# EAGLE design Relay_Board_R2 (EAGLE 7.7.0)
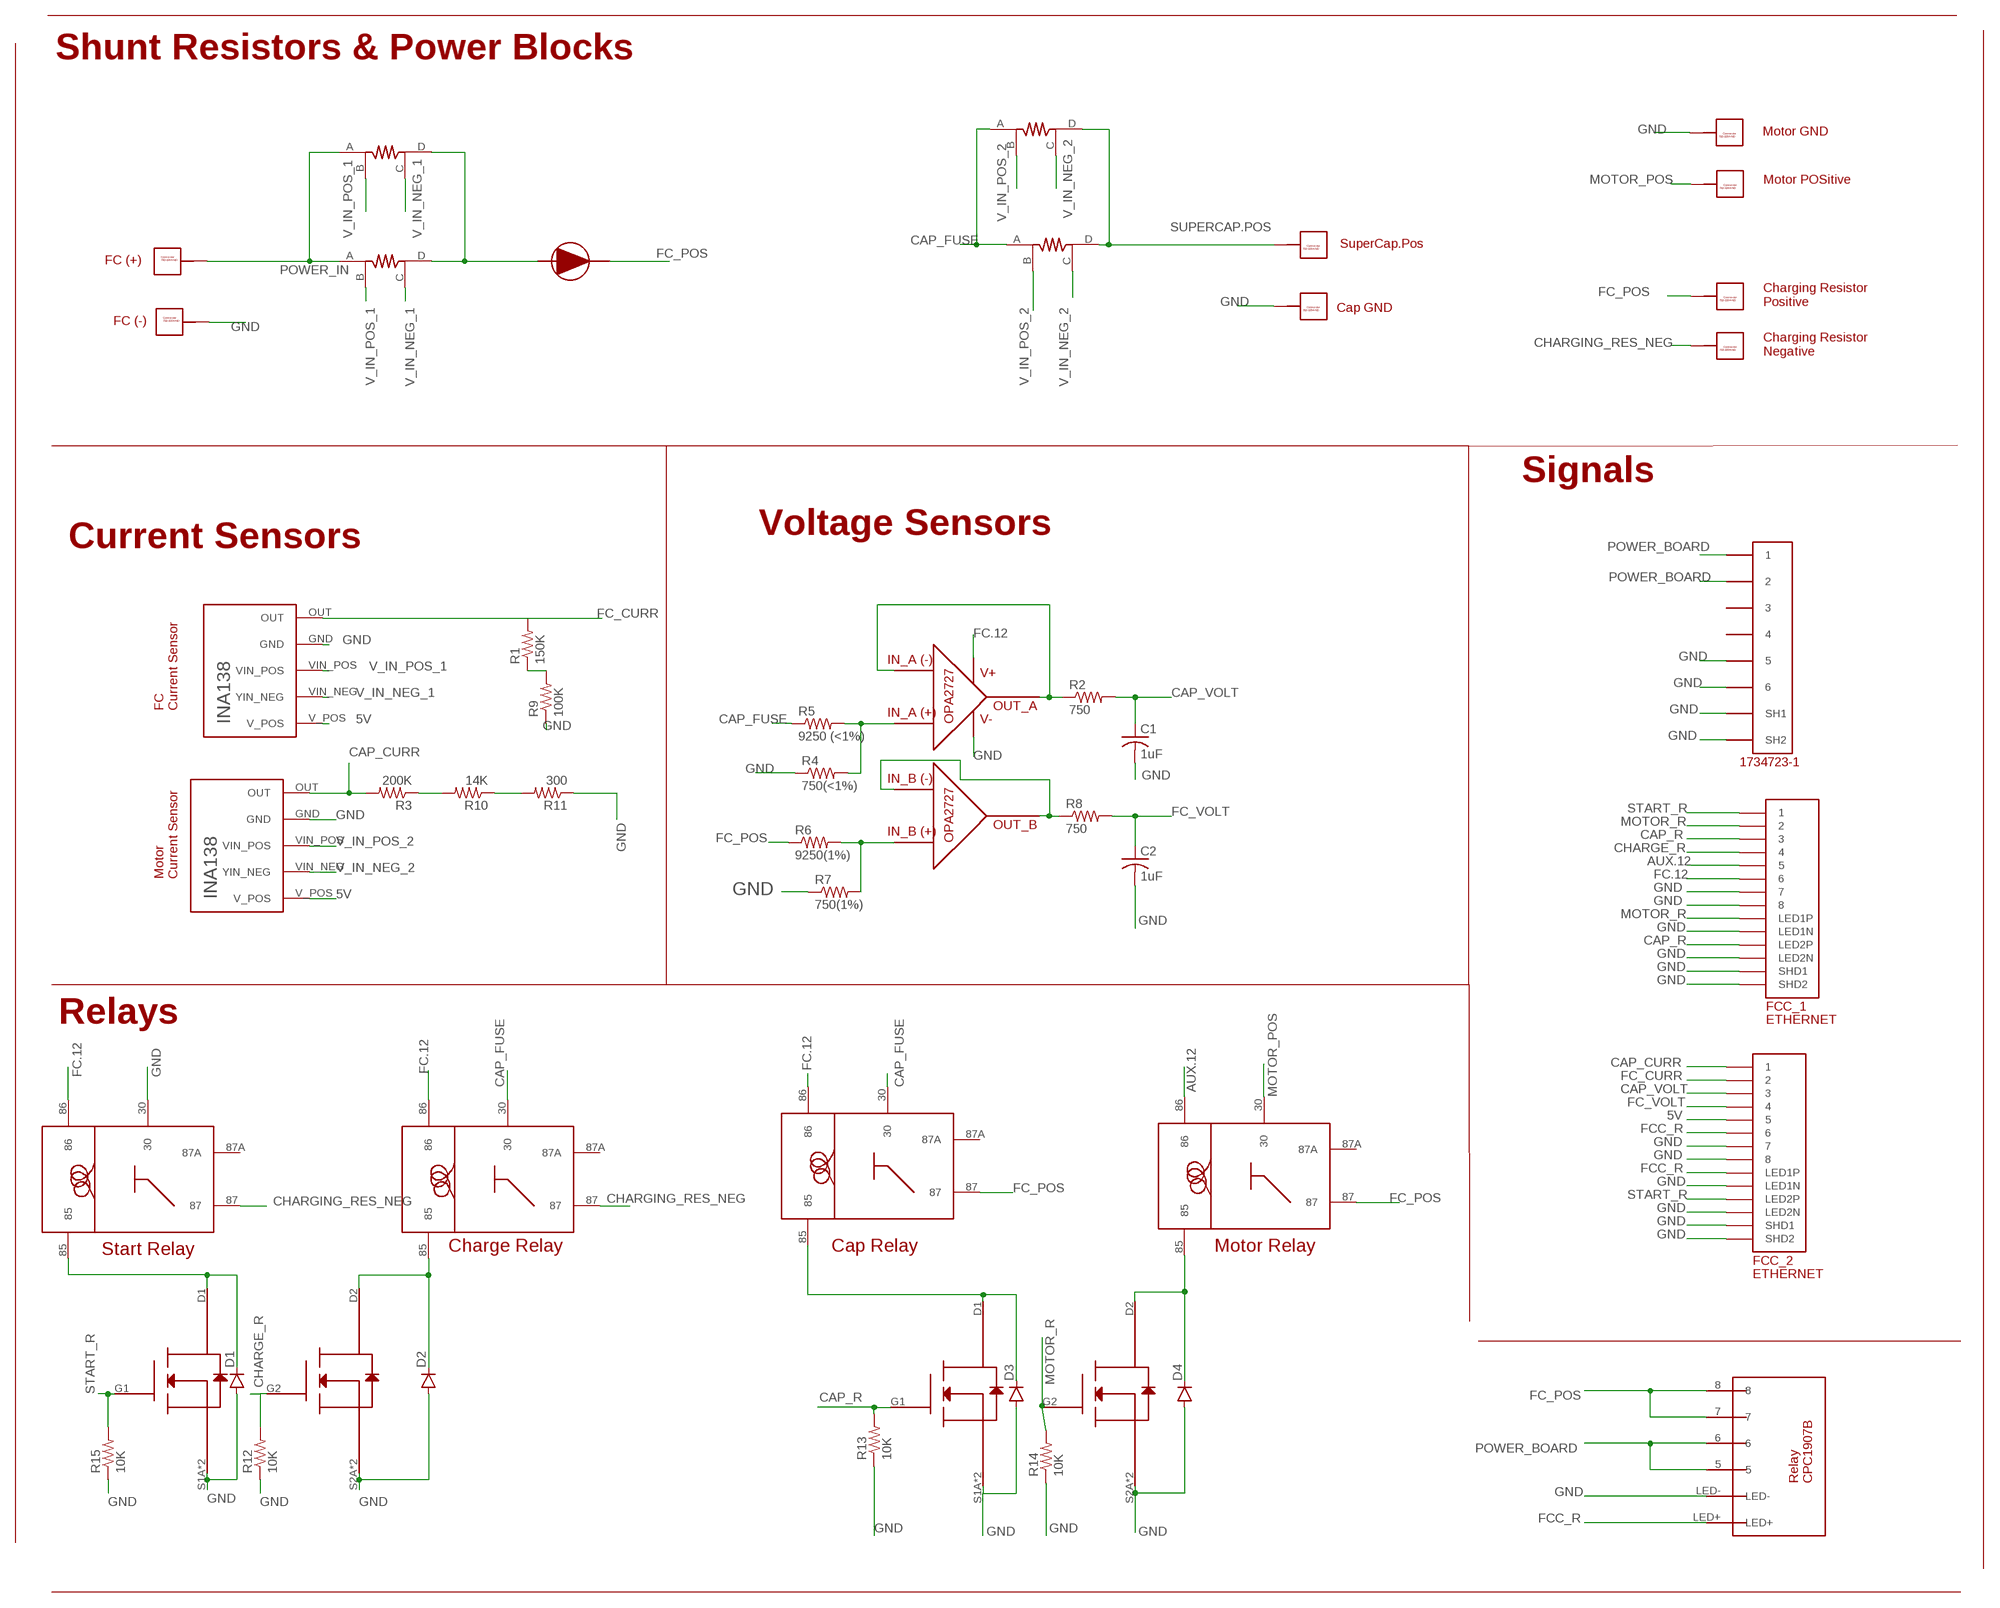
[diagram p0: schematic, sheet 1]

## Parts
C1  1uF  C-USC0805  [C0805]
C2  1uF  C-USC0805  [C0805]
CAP.GND  732-3204-ND_CONNECTOR  [732-3204-ND]
CAP.POS  732-3204-ND_CONNECTOR  [732-3204-ND]
CAP.RELAY  VCF4-1000  [VCF4-1000]
CAP.SHUNT.1  SHUNT_RESISTOR_CSM3637  [CSM3637]
CAP.SHUNT.2  SHUNT_RESISTOR_CSM3637  [CSM3637]
CHARGE_RELAY  VCF4-1000  [VCF4-1000]
D1  DIODESOD123  [SOD-123]
D2  DIODESOD123  [SOD-123]
D3  DIODESOD123  [SOD-123]
D4  DIODESOD123  [SOD-123]
FC.CURR.SENSOR  TI_INA138  [TI_INA138]
FC.GND  732-3204-ND_CONNECTOR  [732-3204-ND]
FC.POS  732-3204-ND_CONNECTOR  [732-3204-ND]
FC.SHUNT.1  SHUNT_RESISTOR_CSM3637  [CSM3637]
FC.SHUNT.2  SHUNT_RESISTOR_CSM3637  [CSM3637]
FC_DIODE  DIODE-APT60S20BG  [DIODE-APT60S20BG]
FCC_1  ETHERNET  [A122645-ND]
FCC_2  ETHERNET  [A122645-ND]
MOTOR.CURR.SENSOR  TI_INA138  [TI_INA138]
MOTOR.GROUND  732-3204-ND_CONNECTOR  [732-3204-ND]
MOTOR.POSITIVE  732-3204-ND_CONNECTOR  [732-3204-ND]
MOTOR.RELAY  VCF4-1000  [VCF4-1000]
R1  150K  R-US_R0805  [R0805]
R2  750  R-US_R0805  [R0805]
R3  200K  R-US_R0805  [R0805]
R4  750(<1%)  R-US_R0805  [R0805]
R5  9250 (<1%)  R-US_R0805  [R0805]
R6  9250(1%)  R-US_R0805  [R0805]
R7  750(1%)  R-US_R0805  [R0805]
R8  750  R-US_R0805  [R0805]
R9  100K  R-US_R0805  [R0805]
R10  14K  R-US_R0805  [R0805]
R11  300  R-US_R0805  [R0805]
R12  10K  R-US_R0805  [R0805]
R13  10K  R-US_R0805  [R0805]
R14  10K  R-US_R0805  [R0805]
R15  10K  R-US_R0805  [R0805]
RES.NEG  732-3204-ND_CONNECTOR  [732-3204-ND]
RES.POS  732-3204-ND_CONNECTOR  [732-3204-ND]
START.RELAY  VCF4-1000  [VCF4-1000]
U$9  SI6926ADQ-T1-E3CT-ND_MOSFET  [SI6926ADQ-T1-E3CT-ND_MOSFET]
U$17  OP-AMP_OPA2727AIDR  [OP-AMP_OPA2727AIDR]
U$19  5555140-6  [1734723-1_RJ11]
U$22  RELAY-CPC1907B  [RELAY-CPC1907B]
U$25  SI6926ADQ-T1-E3CT-ND_MOSFET  [SI6926ADQ-T1-E3CT-ND_MOSFET]

## Nets
5V: FC.CURR.SENSOR.V_POS FCC_2.P$5 MOTOR.CURR.SENSOR.V_POS
AUX.12: FCC_1.P$5 MOTOR.RELAY.86
CAP_CURR: FCC_2.P$1 MOTOR.CURR.SENSOR.OUT R3.2
CAP_FUSE: CAP.RELAY.30 CAP.SHUNT.1.A CAP.SHUNT.2.A CHARGE_RELAY.30 R5.1
CAP_R: FCC_1.P$3 FCC_1.P$12(LED2P) R13.2 U$9.G1
CAP_VOLT: C1.1 FCC_2.P$3 R2.2
CHARGE_R: FCC_1.P$4 R12.2 U$25.G2
CHARGING_RES_NEG: CHARGE_RELAY.87 RES.NEG.P$1 RES.NEG.P$2 RES.NEG.P$3 RES.NEG.P$4 RES.NEG.P$5 RES.NEG.P$6 RES.NEG.P$7 RES.NEG.P$8 RES.NEG.P$9 RES.NEG.P$10 START.RELAY.87
FC.12: CAP.RELAY.86 CHARGE_RELAY.86 FCC_1.P$6 START.RELAY.86 U$17.V+
FC_CURR: FC.CURR.SENSOR.OUT FCC_2.P$2 R1.2
FC_POS: CAP.RELAY.87 FC_DIODE.CATHODE MOTOR.RELAY.87 R6.1 RES.POS.P$1 RES.POS.P$2 RES.POS.P$3 RES.POS.P$4 RES.POS.P$5 RES.POS.P$6 RES.POS.P$7 RES.POS.P$8 RES.POS.P$9 RES.POS.P$10 U$22.7 U$22.8
FC_VOLT: C2.1 FCC_2.P$4 R8.2
FCC_R: FCC_2.P$6 FCC_2.P$10(LED1P) U$22.LED+
GND: C1.2 C2.2 CAP.GND.P$1 CAP.GND.P$2 CAP.GND.P$3 CAP.GND.P$4 CAP.GND.P$5 CAP.GND.P$6 CAP.GND.P$7 CAP.GND.P$8 CAP.GND.P$9 CAP.GND.P$10 D1.A D2.A D3.A D4.A FC.CURR.SENSOR.GND FC.GND.P$1 FC.GND.P$2 FC.GND.P$3 FC.GND.P$4 FC.GND.P$5 FC.GND.P$6 FC.GND.P$7 FC.GND.P$8 FC.GND.P$9 FC.GND.P$10 FCC_1.P$7 FCC_1.P$8 FCC_1.P$9(LED1N) FCC_1.P$11(LED2N) FCC_1.P$13(SHD1) FCC_1.P$14(SHD2) FCC_2.P$7 FCC_2.P$8 FCC_2.P$9(LED1N) FCC_2.P$11(LED2N) FCC_2.P$13(SHD1) FCC_2.P$14(SHD2) MOTOR.CURR.SENSOR.GND MOTOR.GROUND.P$1 MOTOR.GROUND.P$2 MOTOR.GROUND.P$3 MOTOR.GROUND.P$4 MOTOR.GROUND.P$5 MOTOR.GROUND.P$6 MOTOR.GROUND.P$7 MOTOR.GROUND.P$8 MOTOR.GROUND.P$9 MOTOR.GROUND.P$10 R4.1 R7.1 R9.1 R11.1 R12.1 R13.1 R14.1 R15.1 START.RELAY.30 U$9.S1A(S1) U$9.S1B(S1) U$9.S2A(S2) U$9.S2B(S2) U$17.V- U$19.5 U$19.6 U$19.SH1 U$19.SH2 U$22.LED- U$25.S1A(S1) U$25.S1B(S1) U$25.S2A(S2) U$25.S2B(S2)
MOTOR_POS: MOTOR.POSITIVE.P$1 MOTOR.POSITIVE.P$2 MOTOR.POSITIVE.P$3 MOTOR.POSITIVE.P$4 MOTOR.POSITIVE.P$5 MOTOR.POSITIVE.P$6 MOTOR.POSITIVE.P$7 MOTOR.POSITIVE.P$8 MOTOR.POSITIVE.P$9 MOTOR.POSITIVE.P$10 MOTOR.RELAY.30
MOTOR_R: FCC_1.P$2 FCC_1.P$10(LED1P) R14.2 U$9.G2
N$1: R1.1 R9.2
N$3: CAP.RELAY.85 D3.C U$9.D1
N$5: D1.C START.RELAY.85 U$25.D1
N$7: CHARGE_RELAY.85 D2.C U$25.D2
N$9: R4.2 R5.2 U$17.IN_A+
N$10: R6.2 R7.2 U$17.IN_B+
N$11: R8.1 U$17.IN_B- U$17.OUT_B
N$12: R2.1 U$17.IN_A- U$17.OUT_A
N$25: R3.1 R10.2
N$26: R10.1 R11.2
N$29: D4.C MOTOR.RELAY.85 U$9.D2
POWER_BOARD: U$19.1 U$19.2 U$22.5 U$22.6
POWER_IN: FC.POS.P$1 FC.POS.P$2 FC.POS.P$3 FC.POS.P$4 FC.POS.P$5 FC.POS.P$6 FC.POS.P$7 FC.POS.P$8 FC.POS.P$9 FC.POS.P$10 FC.SHUNT.1.A FC.SHUNT.2.A
SHUNT_RES_1: FC.SHUNT.1.D FC.SHUNT.2.D FC_DIODE.ANODE
START_R: FCC_1.P$1 FCC_2.P$12(LED2P) R15.2 U$25.G1
SUPERCAP.POS: CAP.POS.P$1 CAP.POS.P$2 CAP.POS.P$3 CAP.POS.P$4 CAP.POS.P$5 CAP.POS.P$6 CAP.POS.P$7 CAP.POS.P$8 CAP.POS.P$9 CAP.POS.P$10 CAP.SHUNT.1.D CAP.SHUNT.2.D
V_IN_NEG_1: FC.CURR.SENSOR.VIN_NEG(YIN_NEG) FC.SHUNT.1.C FC.SHUNT.2.C
V_IN_NEG_2: CAP.SHUNT.1.C CAP.SHUNT.2.C MOTOR.CURR.SENSOR.VIN_NEG(YIN_NEG)
V_IN_POS_1: FC.CURR.SENSOR.VIN_POS FC.SHUNT.1.B FC.SHUNT.2.B
V_IN_POS_2: CAP.SHUNT.1.B CAP.SHUNT.2.B MOTOR.CURR.SENSOR.VIN_POS
Unconnected: CAP.RELAY.87A CHARGE_RELAY.87A MOTOR.RELAY.87A START.RELAY.87A U$19.3 U$19.4

## Notes on the sheet
- Shunt Resistors & Power Blocks
- Motor GND
- Motor POSitive
- SuperCap.Pos
- FC (+)
- Cap GND
- Charging Resistor
  Positive
- FC (-)
- Charging Resistor
  Negative
- Signals
- Voltage Sensors
- Current Sensors
- FC
  Current Sensor
- Motor
  Current Sensor
- Relays
- Start Relay | Charge Relay | Cap Relay | Motor Relay

## Library data of the parts
C1 C2 = rcl:C-US: CAPACITOR, American symbol
CAP.GND CAP.POS FC.GND FC.POS MOTOR.GROUND MOTOR.POSITIVE RES.NEG RES.POS = Connector 732-3204:732-3204-ND_CONNECTOR
CAP.RELAY CHARGE_RELAY MOTOR.RELAY START.RELAY = VCF4-1000:VCF4-1000: Part for the VCF4-1000 relay socket. Digi-Key Part Number: PB232-ND. Pin numbering is directly taken from the data sheet of the relay. Relay Digi-Key Part Number: 255-2083-ND (Also works with 255-1825-ND). If using relay 255-1825-ND, ignore pin 87A.
CAP.SHUNT.1 CAP.SHUNT.2 FC.SHUNT.1 FC.SHUNT.2 = Vishay_Shunt_Resistor_CSM3637:SHUNT_RESISTOR_CSM3637: Vishay Shunt Resistor CSM3637, 2-200 mOmh's Digikey Number: Y1488-.002BTR-ND; RESISTANCE: 2 - 200 mOhm's
D1-D4 = SparkFun-DiscreteSemi:DIODE: Diode These are standard reverse protection diodes and small signal diodes. SMA package can handle up to about 1A. SOD-323 can handle about 200mA. What the SOD-323 package when ordering, there are some mfgs out there that are 5-pin packages.
FC.CURR.SENSOR MOTOR.CURR.SENSOR = TI_INA138:TI_INA138: Texas Instruments INA138. Datasheet: http://www.ti.com/lit/ds/symlink/ina138.pdf
FC_DIODE = Diode_APT60S20BG-ND:DIODE-APT60S20BG
FCC_1 FCC_2 = ETHERNET-3:ETHERNET: Ethernet port with 2 leds. digikey number A122645-ND
R1-R15 = resistor:R-US_: RESISTOR, American symbol
U$9 U$25 = MOSFET Si6926ADQ:SI6926ADQ-T1-E3CT-ND_MOSFET
U$17 = OP_AMP_OPA2727AIDR:OP-AMP_OPA2727AIDR
U$19 = 5555140-6 RJ11:5555140-6
U$22 = Relay_CPC1907B:RELAY-CPC1907B

## Board
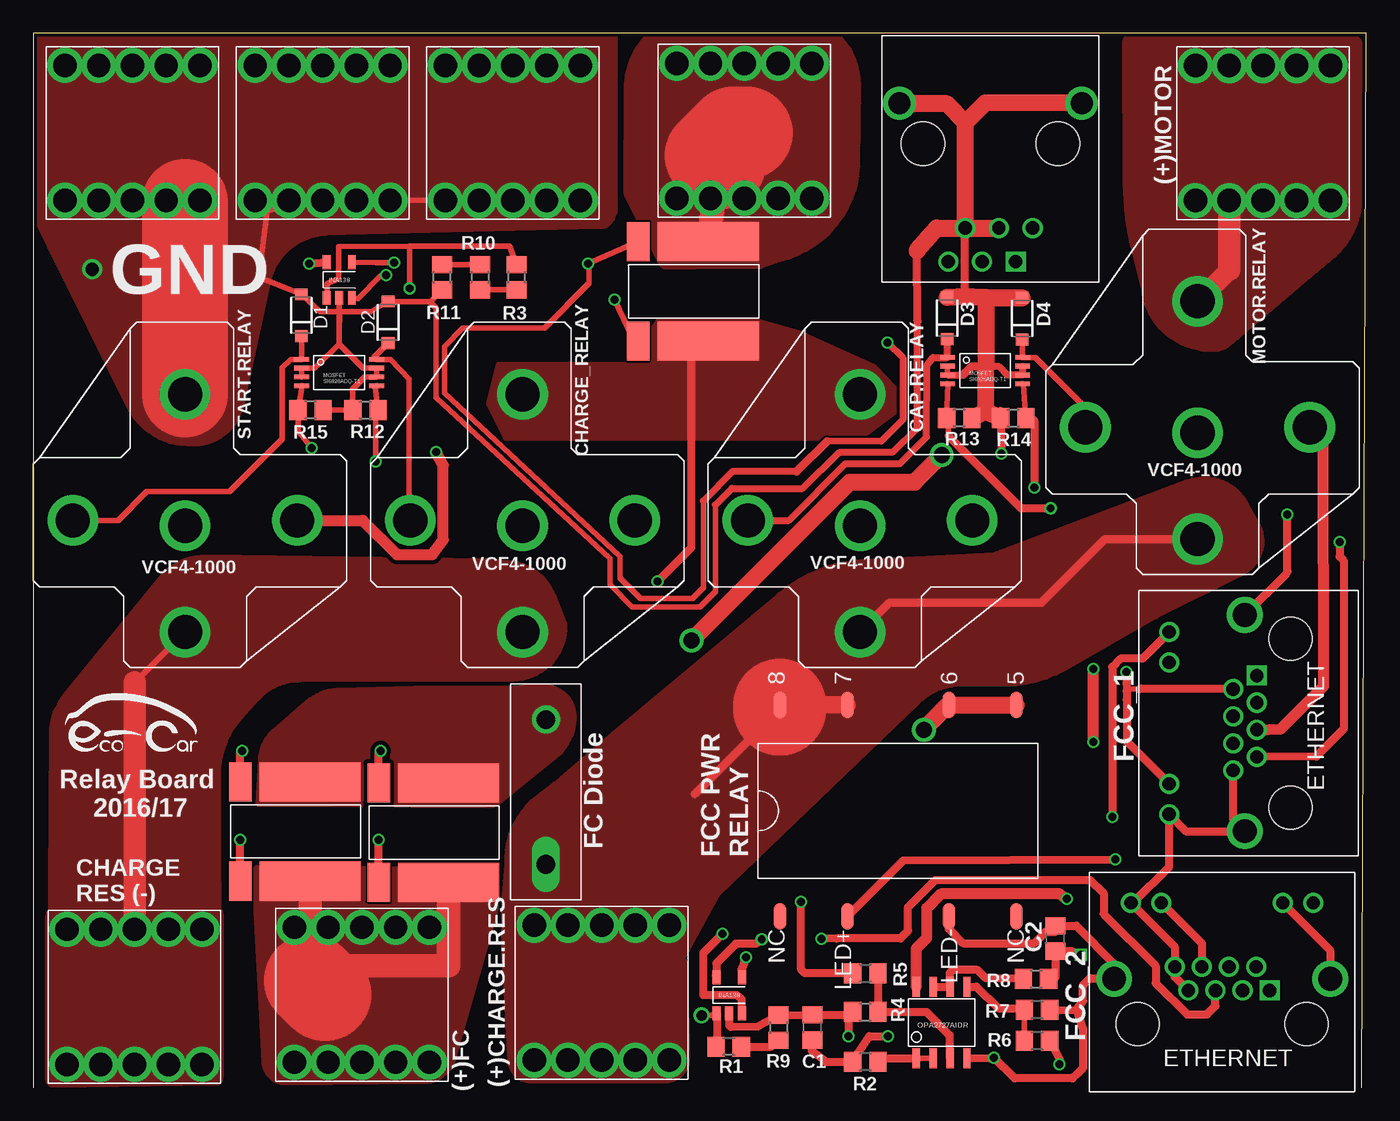
[diagram p1: board, top side]
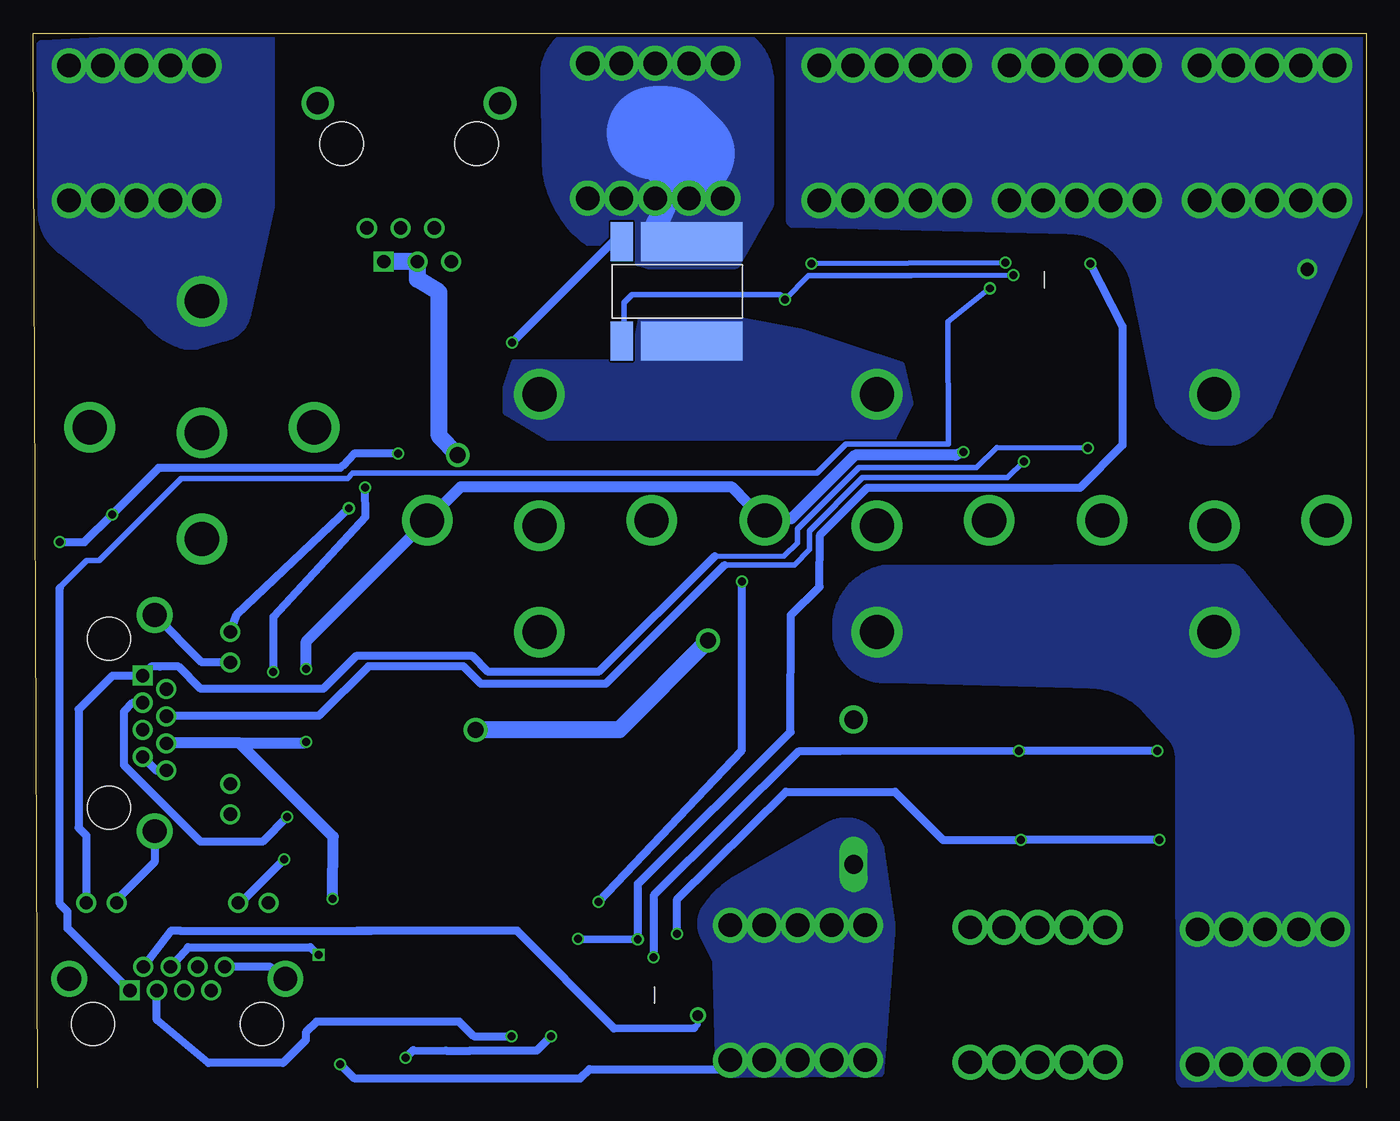
[diagram p2: board, bottom side, seen from below]

Size 100.33 x 79.36 mm. Coordinates in mm from the lower left corner, seen from the top.
Outline: 100,0 100.33,79.36 0,79.36 0,0
Copper layers (1*16): Top 0.035mm / dielectric 1.5mm / Bottom 0.035mm
Design rules "SeeedStudio_2layer_DRU_no_angle_20140221": minimum track width 6mil, minimum drill 12mil, track to track 6mil, track to pad 6mil, pad to pad 6mil, via to via 6mil, smd to smd 0mil, copper to edge 10mil, drill to drill 10mil, minimum pad ring 10mil, minimum via ring 6mil, stop-mask expansion 2mil, vias tented up to drill 100mil, thermal gap 10mil

### Footprints (pad centres in the part's own frame; a part is rotated, then mirrored left to right if it is on the bottom)
C0805 = smd 1.3 x 1.5: 1 -0.95,0; 2 0.95,0
732-3204-ND = drill 1.76: P$1 -5.08,5.08; P$2 -2.54,5.08; P$3 0,5.08; P$4 2.54,5.08; P$5 5.08,5.08; P$6 5.08,-5.08; P$7 2.54,-5.08; P$8 0,-5.08; P$9 -2.54,-5.08; P$10 -5.08,-5.08
VCF4-1000 = drill 2.57 pad 3.81: 30 -17.9,0; 85 -8.407,-8.445; 86 -8.407,8.445; 87 0,0; 87A -8,0
CSM3637 = smd 2.95 x 7.62: A -3.735,0; D 3.735,0 | smd 2.95 x 1.68: B -3.735,5.26; C 3.735,5.26
SOD-123 = smd 0.9 x 0.95: A 1.575,0; C -1.575,0
TI_INA138 = smd 1.05 x 0.6: GND 0,0; OUT 0,0.95; V_POS 2.7,0.95; VIN_NEG 2.7,-0.95; VIN_POS 0,-0.95
DIODE-APT60S20BG = drill 1.4: ANODE 5.45,0 | drill 1.4 long: CATHODE -5.45,0
A122645-ND = drill 1 square: P$1 3.58,2.54 | drill 1: P$2 2.56,4.32; P$3 1.54,2.54; P$4 0.52,4.32; P$5 -0.5,2.54; P$6 -1.52,4.32; P$7 -2.54,2.54; P$8 -3.56,4.32; P$9 -6.86,9.14; P$10 -4.57,9.14; P$11 4.57,9.14; P$12 6.86,9.14 | drill 1.8: P$13 -8.13,3.43; P$14 8.13,3.43 | hole 3.25: -6.35,0; 6.35,0
R0805 = smd 1.3 x 1.5: 1 -0.95,0; 2 0.95,0
SI6926ADQ-T1-E3CT-ND_MOSFET = smd 1.1 x 0.356: D1 -2.82,0.992; D2 2.82,0.992; G1 -2.82,-0.992; G2 2.82,-0.992; S1A -2.82,0.331; S1B -2.82,-0.331; S2A 2.82,0.331; S2B 2.82,-0.331
OP-AMP_OPA2727AIDR = smd 1.5 x 0.55: IN_A+ -2.7,-0.635; IN_A- -2.7,0.635; IN_B+ 2.7,-1.905; IN_B- 2.7,-0.635; OUT_A -2.7,1.905; OUT_B 2.7,0.635; V+ 2.7,1.905; V- -2.7,-1.905
1734723-1_RJ11 = drill 1 square: 1 -2.54,2.54 | drill 1: 2 0,2.54; 3 2.54,2.54; 4 -3.81,0; 5 -1.27,0; 6 1.27,0 | drill 1.65: SH1 -7.5,-9.4; SH2 6.22,-9.4 | hole 3.3: -5.72,-6.35; 4.44,-6.35
RELAY-CPC1907B = smd 2 x 0.95: 5 7.95,-8.891; 6 7.95,-3.809; 7 7.95,3.811; 8 7.95,8.891; LED+ -7.95,3.811; LED- -7.95,-3.811; NC_1 -7.95,8.891; NC_2 -7.95,-8.891

### Placement (x,y rotation side)
C1  58.63,4.53 90 top
C2  76.93,11.23 90 top
CAP.GND  21.78,71.86 0 top
CAP.POS  53.52,72.02 0 top
CAP.RELAY  62.23,34.29 270 top
CAP.SHUNT.1  50.8,59.93 90 top
CAP.SHUNT.2  50.77,59.93 90 bottom
CHARGE_RELAY  36.83,34.29 270 top
D1  20.17,58.13 90 top
D2  26.71,57.61 90 top
D3  68.79,57.92 90 top
D4  74.44,57.89 90 top
FC.CURR.SENSOR  52.38,5.61 90 top
FC.GND  7.47,71.86 0 top
FC.POS  24.74,6.99 0 top
FC.SHUNT.1  31.27,19.2 90 top
FC.SHUNT.2  20.85,19.28 90 top
FC_DIODE  38.59,22.26 90 top
FCC_1  94.63,27.44 90 top
FCC_2  89.48,4.77 0 top
MOTOR.CURR.SENSOR  23.03,59.44 90 top
MOTOR.GROUND  36.09,71.86 0 top
MOTOR.POSITIVE  92.55,71.85 0 top
MOTOR.RELAY  87.63,41.29 270 top
R1  52.34,3.09 180 top
R2  62.62,1.94 180 top
R3  36.39,61 90 top
R4  62.62,5.69 0 top
R5  62.62,8.61 0 top
R6  75.55,3.52 180 top
R7  75.55,5.85 180 top
R8  75.48,8.18 0 top
R9  56.09,4.52 270 top
R10  33.62,61 270 top
R11  30.77,61 90 top
R12  25,51 0 top
R13  69.7,50.4 180 top
R14  73.76,50.39 0 top
R15  20.88,51 180 top
RES.NEG  7.62,6.83 0 top
RES.POS  42.78,7.14 0 top
START.RELAY  11.43,34.29 270 top
U$9  71.64,53.97 0 top
U$16  [LOGO]  7.78,27.07 0 top
U$17  68.37,4.9 90 top
U$19  71.41,64.71 180 top
U$22  65.09,20.84 90 top
U$25  23.03,53.82 0 top

### Tracks (layer width: path | path; a pad name or v marks a point on that pad's centre or on a via)
5V  (via drill 0.6)
  Top 0.406: 51.27,8.46 51.4,8.34 FC.CURR.SENSOR.V_POS | 80.57,13.11 80.59,13.06
  Top 0.61: 51.4,8.34 51.41,9.35 52.88,10.83 54.42,10.83 v54.83,11.16 | FCC_2.P$5 88.98,6.16 88.33,5.51 86.84,5.51 84.48,7.85 84.48,9.17 80.59,13.06 | 80.57,13.11 80.57,14.61 79.54,15.64 67.9,15.64 65.85,13.58 65.85,11.8 65.28,11.23 60.48,11.23 v59.31,11.2 | v20.78,62.02 MOTOR.CURR.SENSOR.V_POS
  Bottom 0.61: v20.78,62.02 18.35,57.31 18.35,48.35 21.55,45.13 37.56,45.13 41.12,41.6 41.14,37.7 43.31,35.56 43.33,26.77 54.81,15.34 v54.83,11.16 v59.31,11.2
AUX.12
  Top 0.406: FCC_1.P$5 92.5,26.93
  Top 0.813: FCC_1.P$5 93.88,26.99 97.12,30.23 97.08,48.57 MOTOR.RELAY.86
CAP_CURR  (via drill 0.6)
  Top 0.406: R3.2 35.84,63.35 28.31,63.33 | MOTOR.CURR.SENSOR.OUT 22.11,60.51 22.98,60.9 23,63.31 28.31,63.33 | 28.31,63.33 v28.31,60.16
  Bottom 0.406: 98.32,37.64 96.3,39.66 95.37,39.66 89.19,45.84 89.19,45.86 76.67,45.86 76.28,46.25 74.49,46.25 74.03,46.27 41.35,46.27 39.18,48.45 31.46,48.46 31.49,57.65 v28.31,60.16
  Bottom 0.61: 98.32,37.64 98.32,13.83 97.74,13.25 97.74,11.99 FCC_2.P$1
CAP_FUSE  (via drill 0.6)
  Top 0.406: 49.53,54.93 CAP.SHUNT.1.A
  Top 0.61: R5.1 58.07,8.61 57.78,8.89 v57.78,13.97 | v46.99,38.1 49.53,40.64 49.53,54.93
  Bottom 0.61: v57.78,13.97 46.99,25.4 v46.99,38.1
  pour Bottom (no thermals): 46.99,57.79 42.57,56.95 34.95,54.41 34.29,51.44 35.56,48.9 61.59,48.9 64.77,50.8 64.77,52.71 64.14,54.61 55.24,54.61 54.61,57.79
  pour Top (no thermals): 54.46,57.71 57.56,56.85 63.3,54.23 64.77,52.71 64.77,50.8 62.23,48.9 35.56,48.9 34.29,51.44 35.03,54.43 44.55,54.43 47.07,57.68
CAP_R  (via drill 0.6)
  Top 0.406: U$9.G1 68.85,52.96 R13.2 68.89,50.99 68.89,49.05
  Top 0.61: v76.57,43.61 74.33,43.61 68.89,49.05 | FCC_1.P$12 83.5,32.3 81.83,32.3 81.21,31.67 v81.21,20.37
  Bottom 0.61: v76.57,43.61 85.05,35.57 FCC_1.P$12 | v81.21,20.37 83.08,18.5 87.74,18.5 93.5,24.26 93.5,28.3 92.83,28.97 FCC_1.P$3
CAP_VOLT  (via drill 0.6)
  Top 0.61: C1.1 58.59,2.78 59.65,1.93 R2.2 62.93,3.88 v64.32,3.88
  Bottom 0.61: FCC_2.P$3 91.02,5.09 87.16,1.87 81.52,1.87 79.81,3.58 79.81,4.15 79,4.96 68.27,4.96 67.18,3.88 v64.32,3.88
CHARGE_R  (via drill 0.6)
  Top 0.406: U$25.G2 25.75,52.73 R12.2 25.78,50.92 25.78,48.69 v25.78,47.12
  Bottom 0.406: 48.28,39.32 43.05,39.34 41.91,40.49 41.91,41.89 37.93,45.91 27,45.91 v25.78,47.12 | 90.29,27.98 FCC_1.P$4
  Bottom 0.61: 48.28,39.32 57.25,30.39 66.62,30.39 67.95,31.71 75.1,31.71 78.83,27.98 90.29,27.98
CHARGING_RES_NEG
  Top 0.406: START.RELAY.87 7.62,30.48
  Top 1.676: 7.62,30.48 RES.NEG.P$3
  pour Top (no thermals): 13.69,13.06 13.69,0.77 1.56,0.61 1.56,12.9
  pour Top (isolate 0.305, rank 2, no thermals): 39.28,36.65 arc61 36.26,39.45 34.24,39.63 13.03,39.93 arc52 9.6,38.32 2.42,29.5 arc39 1.39,26.64 1.27,9.53 13.97,7.62 13.9,23.51 arc-42 15.57,27.86 16.83,29.26 arc-48 20.09,30.72 36.12,30.77 arc92 39.98,34.84
  pour Bottom (no thermals): 39.58,34.74 arc78 36.2,38.74 10.82,38.81 arc52 9.8,38.64 2.79,29.85 arc39 1.55,26.31 1.55,0.77 13.68,0.61 13.71,24.75 arc-42 14.45,26.63 16.29,28.65 arc-46 20.68,30.65 35.83,31.07 arc101
FC.12  (via drill 0.6)
  Top 0.813: U$17.V+ 66.46,10.47 67.26,11.26 67.26,13.5 68.37,14.61 77.21,14.61 v77.78,14.21 | v79.78,26.04 v79.78,31.52 | START.RELAY.86 24.81,42.7 27.38,40.13 30.04,40.13 30.86,41.22 30.86,46.86 v30.31,47.84
  Bottom 0.406: 90.27,25.96 FCC_1.P$6 | 79.86,25.96 v79.78,26.04 | 45.28,42.72 CHARGE_RELAY.86
  Bottom 0.813: v77.78,14.21 77.76,18.88 84.83,25.96 | 84.83,25.96 90.27,25.96 | 84.83,25.96 79.86,25.96 | v79.78,31.52 79.78,33.59 CAP.RELAY.86 68.13,45.24 47.78,45.24 CHARGE_RELAY.86 | v30.31,47.84 30.89,47.6 38.48,47.61 43.28,42.8 45.28,42.72
FC_CURR  (via drill 0.8)
  Top 0.406: 51.47,5.58 51.24,5.58 FC.CURR.SENSOR.OUT 51.25,5.43 v50.31,5.43 | 51.47,3.4 R1.2
  Top 0.61: 51.47,5.58 51.47,3.4
  Bottom 0.406: 89.3,11.82 | 50.56,4.5 50.31,4.75 v50.31,5.43
  Bottom 0.61: FCC_2.P$2 89.94,11.82 89.3,11.82 | 89.3,11.82 74.81,11.82 75.92,11.81 63.91,11.81 56.62,4.45 50.56,4.5
FC_POS  (via drill 0.6)
  Top 0.406: 77.23,2.16 v77.23,1.78
  Top 0.61: CAP.RELAY.87 64.45,36.51 75.88,36.51 80.66,41.29 MOTOR.RELAY.87 | R6.1 77.23,2.16 | 56.2,28.49 49.78,22.08
  Top 1.27: U$22.7 U$22.8
  Top 7: U$22.8 56.2,28.49
  Bottom 0.406: 48.54,1.39 RES.POS.P$6
  Bottom 0.61: 48.54,1.39 58.47,1.39 59.17,0.69 70.68,0.69 76.19,0.71 v77.23,1.78
  pour Top (rank 4, no thermals): 48.9,9.53 49.11,2.24 arc-92 47.54,0.61 37.5,0.61 arc-87 36.01,2.02 35.56,10.16 35.56,13.97 35.76,16.79 arc-48 37.62,21.43 39.27,22.71 43.72,26.55 56.24,37.02 arc-37 62.72,39.54 72.39,40.01 86.91,45.49 arc-81 91.14,43.94 92.01,42.4 arc-93 90.89,38.78 84.45,35.56 77.66,31.68 arc-30 73.15,30.48 69.89,30.48 arc44 66.54,29.13 51.44,14.61 48.6,9.48
  pour Bottom (no thermals): 36.61,1.07 47.31,1 arc89 48.73,2.38 48.9,9.53 49.82,11.34 arc60 49.7,13.53 arc26 47.49,15.62 40.51,19.69 arc112 36.56,17.78 35.74,12.12
FC_VOLT  (via drill 0.6)
  Top 0.406: 76.93,8.24 R8.2
  Top 0.61: 76.93,8.24 C2.1 78.15,10.29 v78.84,9.99
  Bottom 0.61: FCC_2.P$4 88.68,10.56 79.46,10.56 v78.84,9.99
FCC_R  (via drill 0.6)
  Top 0.61: U$22.LED+ 65.48,17.09 v81.43,17.16 | FCC_2.P$10 87.96,10.86 FCC_2.P$6
  Bottom 0.406: 84.71,13.91 FCC_2.P$10
  Bottom 0.61: v81.43,17.16 84.71,13.91
GND  (via drill 0.6, 1)
  Top 0.406: MOTOR.CURR.SENSOR.GND 23.02,59.45 23.02,58.85 | 23.02,57.68 23.05,57.67 23.02,58.85 | R12.1 24.05,52.57 24.96,53.48 25.84,53.48 U$25.S2B U$25.S2A 24.83,54.15 23.02,55.97 | U$25.S1B U$25.S1A 21.2,54.15 23.02,55.97 | 23.02,55.97 23.02,57.68 | 23.02,57.68 23.02,58.42 | 23.02,58.42 23.02,58.85 | MOTOR.GROUND.P$10 20.3,66.78 17.6,65.99 16.96,61.01 D1.A 21.59,58.42 23.02,58.42 | 24.03,50.93 R12.1 | U$9.S1A U$9.S1B | 72.79,51.04 R14.1 72.81,49.72 | 71.67,50.88 71.69,50.91 | U$9.S2B | 58.68,5.46 C1.2 | 61.47,5.49 R4.1 61.35,5.57 | R7.1 78.51,5.88 | 81.47,8.23 FCC_2.P$13 | 76.96,11.73 C2.2 | v72.31,2.24 72.04,2.19 | 52.38,4.68 52.48,4.58 | 82.78,13.91 FCC_2.P$9 | 51.34,43.86 51.34,37.35 50.18,36.2 45.09,36.2 43.41,37.88 43.41,39.82 30.34,51.95 30.34,58.69 29.84,59.18 | 70.16,64.71 U$19.6 | 71.49,59.5 71.69,59.5 71.72,59.46 | 65.19,74.04 U$19.SH2 | 94.39,38.87 94.34,38.71 | R15.1 R12.1 | 23.02,58.42 25.4,58.42 D2.A 29.84,59.18 | 29.84,59.18 29.9,59.18 R11.1 | 78.53,1
  Top 0.508: U$9.S2A U$9.S2B | U$9.S1B 69.98,53.64 | U$9.S2B 73.32,53.64 72.7,54.26 71.69,54.26 | 51.34,43.86 52.58,45.1 57.89,45.1 60.68,47.83 64.72,47.84 66.55,49.66 66.55,57.68
  Top 0.61: 69.98,53.64 70.6,54.26 71.69,54.26 | 52.48,4.58 54.55,4.6 R9.1 58.68,5.46 | C1.2 61.47,5.49 | 78.51,5.88 79,4.39 79,1.46 78.53,1 78.22,0.69 73.87,0.69 v72.31,2.24 | R7.1 78.51,5.83 79,6.52 79,7.69 79.54,8.23 81.47,8.23 | U$22.LED- 68.9,11.95 69.98,10.87 75.34,10.87 76.2,11.73 76.96,11.73 | 72.04,2.19 U$17.V- | C2.2 78.51,12.19 81.35,9.3 FCC_2.P$13 | 72.81,49.72 v72.88,47.72 | FCC_1.P$14 94.34,38.71 | 94.39,38.87 v94.39,43.14 | FC.CURR.SENSOR.GND 52.38,4.68 | FCC_1.P$7 96.57,24.92 98.64,26.99 98.64,39.66 98.32,39.97 v98.32,41.06 | FCC_1.P$8 90.31,20.19 FCC_1.P$13 86.76,19.3 FCC_1.P$9 85.49,16.62 82.78,13.91 | FCC_2.P$11 97.61,10.35 FCC_2.P$14 | FCC_2.P$9 85.92,10.61 FCC_2.P$8 85.92,8.33 FCC_2.P$7 | 61.35,5.57 v61.35,3.88 | 70.14,59.58 U$19.6 | 66.55,57.68 66.52,63
  Top 1.27: R13.1 71.69,50.91 71.69,54.26 71.69,59.5 | R14.1 71.67,50.88 | D3.A 70.14,59.58 71.49,59.5 | U$19.5 70.16,64.71 70.16,72.64 | 71.72,59.46 D4.A | 66.52,63 68,64.71 U$19.6 | 70.16,72.64 68.76,74.04 65.19,74.04 | U$19.SH1 71.65,74.12 70.16,72.64
  Top 6.452: START.RELAY.30 11.43,66.67
  Bottom 0.406: 77.06,46.8 | 77.06,46.8 77.21,46.64 | 94.05,14.14 FCC_2.P$11
  Bottom 0.61: FCC_2.P$13 82.47,9.09 FCC_2.P$8 | FCC_1.P$8 91.07,23.88 FCC_1.P$7 | FCC_1.P$13 91.2,16.99 94.05,14.14 | v72.31,2.24 71.73,2.81 69.27,2.79 67.42,2.79 62.44,2.79 v61.35,3.88 | FCC_1.P$11 87.64,32.01 FCC_1.P$14 | v72.88,47.72 76.18,47.72 77.06,46.8 | 77.21,46.64 90.9,46.64 v94.39,43.14 96.48,41.06 v98.32,41.06
  other vias: 4.45,61.59
  pour Top (no thermals): 43.21,65.8 arc-86 42.64,65.24 21.97,64.76 arc77 17.15,60.38 15.19,51.33 arc-77 12.1,48.9 11.68,48.9 arc-64 7.65,51.39 0.13,66.6 -1.77,80.47 43.35,80.06 43.35,66.02
  pour Bottom (no thermals): 43.05,65.33 43.05,81.74 -0.89,79.84 -2.79,67.7 arc-131 0.16,67.66 7.62,50.8 8.69,49.73 arc45 10.7,48.9 11.13,48.9 arc63 15.24,51.44 17.03,60.39 arc-77 22.36,64.86
MOTOR_POS
  Top 1.422: MOTOR.RELAY.30 90.01,61.58
  Top 1.676: 90.01,61.58 MOTOR.POSITIVE.P$9
  pour Top (no thermals): 99.41,78.55 99.41,67.14 arc-53 97.2,62.66 89.62,56.23 arc-48 87.79,56.12 arc-74 84.04,60.08 83.23,63.39 arc-13 82.66,67.99 82.61,78.67
  pour Bottom (no thermals): 91.64,58.18 98.13,63.38 arc50 99.36,65.89 99.56,78.24 82.78,79.14 82.78,66.37 84.54,58.5 arc77 86.09,56.77 88.33,56.07 arc48
MOTOR_R  (via drill 0.6)
  Top 0.406: U$9.G2 74.51,52.93 R14.2 75.34,50.22 | 83.25,29.99 82.44,29.99 82.3,29.86
  Top 0.61: 75.34,50.22 v75.34,45.16 | FCC_1.P$2 83.25,29.99 | 82.3,29.86 82.3,29.21 | 82.3,29.21 82.3,26.06 FCC_1.P$10 | v82.27,31.28 82.3,29.21
  Bottom 0.61: v82.27,31.28 82.27,35.43 75.33,42.98 v75.34,45.16
N$1
  Top 0.61: R1.1 55.54,3.09 R9.2
N$3
  Top 0.406: U$9.D1 68.79,54.96
  Top 0.508: CAP.RELAY.85 56.87,42.7 61.14,46.97 65.23,46.97 67.24,48.98 67.27,54.35 67.72,54.96 U$9.D1 | 68.79,54.96 D3.C
N$5
  Top 0.406: START.RELAY.85 6.4,42.7 8.55,44.85 14.77,44.85 18.74,48.82 18.74,54.18 19.36,54.8 20.2,54.8 U$25.D1 20.21,56.52 D1.C
N$7
  Top 0.406: D2.C 25.67,54.99 U$25.D2 25.85,54.8 26.9,54.8 28.3,53.33 28.3,42.7 CHARGE_RELAY.85
N$9
  Top 0.406: 68.97,2.24 U$17.IN_A+ | 63.59,5.69 R4.2
  Top 0.61: 68.97,2.24 68.97,3.95 67.23,5.69 63.59,5.69 R5.2
N$10
  Top 0.406: R6.2 R7.2 74.15,5.97
  Top 0.61: U$17.IN_B+ 71,7.6 72.62,5.97 74.15,5.97
N$11
  Top 0.406: 68.97,7.63 U$17.IN_B-
  Top 0.61: U$17.OUT_B U$17.IN_B- | R8.1 71.69,8.23 71.07,8.85 69.2,8.85 68.97,8.62 68.97,7.63
N$12
  Top 0.406: U$17.IN_A- U$17.OUT_A 66.42,2.25 | R2.1 64.29,2.2
  Top 0.61: 64.29,2.2 U$17.OUT_A
N$25
  Top 0.406: R10.2 R3.1
N$26
  Top 0.406: R11.2 R10.1
N$29
  Top 0.406: MOTOR.RELAY.85 79.18,51.2 75.42,54.96 U$9.D2 | U$9.D2 | U$9.D2 74.44,54.96 D4.C
POWER_BOARD  (via drill 1.2)
  Top 1.27: U$22.5 U$22.6 68.8,28.76 v67.03,26.93 | v49.53,33.66 52.33,36.45 61.45,45.57 66.33,45.57 67.18,46.44 v68.38,47.63
  Bottom 1.27: v49.53,33.66 56.23,26.93 v67.03,26.93 | v68.38,47.63 69.77,49.05 69.8,59.87 71.41,60.85 U$19.2 U$19.1
POWER_IN
  Top 1.778: FC.SHUNT.2.A 20.85,8.08 | FC.SHUNT.1.A 31.27,9.17 22.71,9.17
  Top 7: 20.85,8.08 21.94,6.99
  pour Top (no thermals): 34.34,13.31 31.19,2.26 arc-73 29.41,0.9 19.09,0.78 arc-88 17.81,1.97 17.07,16.18 34.41,15.95
SHUNT_RES_1
  pour Top (isolate 0.305, rank 3, no thermals): 16.93,21.36 34.21,21.24 arc40 35.14,21.57 39.28,24.93 arc49 40.7,27.79 arc91 38.43,30.18 35.74,30.23 22.92,29.88 arc40 20.59,28.97 18.17,26.86 arc46 17.1,24.66
START_R  (via drill 0.6)
  Top 0.406: U$25.G1 20.23,52.86 R15.2 19.93,49.43 v20.94,48.14
  Bottom 0.406: v20.94,48.14 27.8,48.16 29.34,46.66 38.19,46.68 42.82,42.06 42.82,41 43.84,40.01 49.04,39.99
  Bottom 0.61: 49.04,39.99 57.8,31.29 66.08,31.29 67.25,32.49 76.05,32.49 78.51,30.03 87.72,30.03 89.39,31.7 90.81,31.7 91.46,31.68 FCC_1.P$1 94.37,31.01 96.91,28.47 96.91,19.55 96.34,18.98 FCC_2.P$12
SUPERCAP.POS
  Top 1.778: CAP.SHUNT.1.D 51.66,69.62
  Top 7: 51.66,69.62 51.03,70.15 52.74,71.86 53.67,71.86
  Bottom 1.676: CAP.SHUNT.2.D 53.57,64.56 51.03,70.31
  Bottom 7: 51.03,70.31 52.58,71.86 53.67,71.86
  pour Top (no thermals): 45.09,67.31 45.12,75.38 arc-89 49.96,80.22 56.87,80.25 arc-91 61.64,75.45 61.58,69.62 arc-71 56.75,62.96 54.61,62.23 52.07,62.23 47.77,62.17 arc-64 47.68,62.23
  pour Bottom (no thermals): 45.19,66.54 45.19,75.66 arc-91 49.32,79.73 58.43,79.59 arc-90 61.54,75.71 61.43,70.2 arc-74 56.37,62.88 53.98,62.23 47.62,62.23
V_IN_NEG_1  (via drill 0.6)
  Top 0.406: 26.01,25.22 v26.14,25.35 | 15.59,25.22 v15.71,25.35
  Top 0.61: FC.SHUNT.1.C 26.01,25.22 | v53.63,9.82 53.3,8.87 FC.CURR.SENSOR.VIN_NEG | FC.SHUNT.2.C 15.59,25.22
  Bottom 0.61: v15.71,25.35 v26.14,25.35 39.65,25.32 42.75,25.3 53.63,14.47 v53.63,9.82
V_IN_NEG_2  (via drill 0.6)
  Top 0.406: v41.75,62.02 41.84,62.04 | 41.84,62.04 CAP.SHUNT.1.C | v27.15,62.1 25.79,62.08 MOTOR.CURR.SENSOR.VIN_NEG | 50.44,44.17 50.44,37.66 49.61,36.83 45.72,36.83 44.18,38.37 44.18,39.97 30.96,52.26 30.96,55.79 32.33,57.19 38.48,57.19 41.85,60.56 41.84,62.04 | CAP.SHUNT.1.C
  Top 0.508: v64.29,56.07 65.46,54.94 65.46,50.27 63.8,48.64 59.77,48.67 | 57.45,46.36 52.63,46.36 50.44,44.17
  Top 0.61: 59.77,48.67 57.45,46.36
  Bottom 0.406: v27.15,62.1 v41.75,62.02
  Bottom 0.61: v64.29,56.07 56.69,63.67 CAP.SHUNT.2.C
V_IN_POS_1  (via drill 0.6)
  Top 0.406: 25.98,15.49 FC.SHUNT.1.B
  Top 0.61: FC.CURR.SENSOR.VIN_POS 53.33,6.62 52.96,6.96 50.44,6.96 50.44,10.13 v51.88,11.59 | FC.SHUNT.2.B v15.59,18.64 | 25.98,15.49 v25.98,18.64
  Bottom 0.61: v51.88,11.59 51.87,14.17 43.68,22.27 35.47,22.27 31.86,18.64 v25.98,18.64 v15.59,18.64
V_IN_POS_2  (via drill 0.6)
  Top 0.406: MOTOR.CURR.SENSOR.VIN_POS 24.47,59.4 26.1,61.09 v26.57,61.14 | CAP.SHUNT.1.B 45.06,56.52 v43.76,59.31
  Bottom 0.406: CAP.SHUNT.2.B 55.85,56.18 55.85,59.08 55.24,59.69 44.14,59.69 v43.76,59.31 41.97,61.11 38.35,61.11 34.29,61.11 v26.57,61.14

### Text on the board
tNames: (+)MOTOR | GND | Relay Board / 2016/17 | FC Diode | FCC PWR / RELAY | CHARGE / RES (-) | (+)CHARGE.RES | (+)FC
tValues: (+)CAP
bValues: GND | GND | GND | (+)MOTOR | CAP + | GND | CHARGE / RES (-) | (+)FC | (+)CHARGE.RES